# Altium project MarsRover_ScienceTeam.PrjPcb
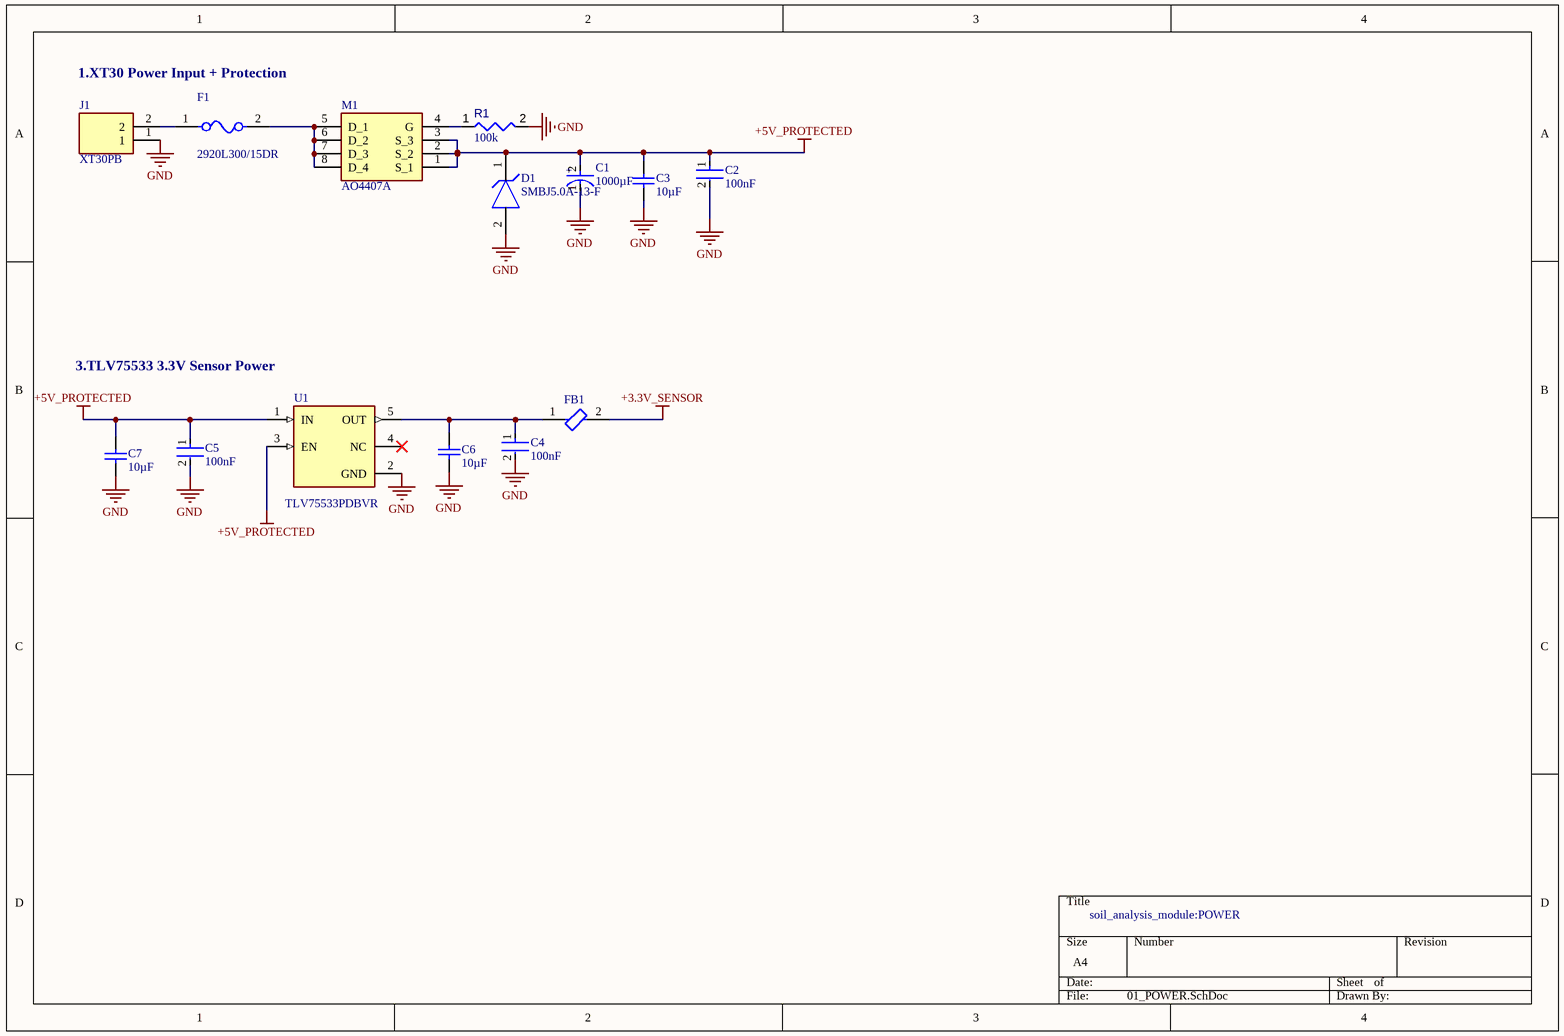
[diagram p0: 01_POWER.SchDoc]
3 sheets, 40 parts. Net scope: global (net labels, ports and power ports of the same name join across sheets).
Board file: PCB1.PcbDoc
Sheets:
  01_POWER.SchDoc
  02_ESP32.SchDoc
  03_CONNECTION.SchDoc

## Sheet 01_POWER.SchDoc
size A4; SheetNumber: 1; SheetTotal: 3

### Parts
C1  value 1000µF  [FP-RAD-TH-D_8_0_5-L_15_1-MFG]  (hidden comment: EEUFR1A102L)
C2  value 100nF  [FP-CC1206-1_25-MFG]  (hidden comment: CC1206KRX7R9BB104)
C3  value 10µF  [CAPC3216X180X55ML20T25]  (hidden comment: GRM31CR71C106KA12L)
C4  value 100nF  [FP-CC1206-1_25-MFG]  (hidden comment: CC1206KRX7R9BB104)
C5  value 100nF  [FP-CC1206-1_25-MFG]  (hidden comment: CC1206KRX7R9BB104)
C6  value 10µF  [CAPC3216X180X55ML20T25]  (hidden comment: GRM31CR71C106KA12L)
C7  value 10µF  [CAPC3216X180X55ML20T25]  (hidden comment: GRM31CR71C106KA12L)
D1  SMBJ5.0A-13-F  [FP-SMB-MFG]
F1  2920L300/15DR  [FP-2920L-MFG]
FB1  BLM31PG121SN1L  [FP-BLM31-0_2-t1_1-MFG]  (value not drawn)
J1  XT30PB  [XT30PB-Footprint-1]
M1  AO4407A  [AO4407A-Footprint-1]
R1  value 100k  [RESC3216X60X45ML15T20]  (hidden comment: Resistor 100k +/-1% 1206 250 mW)
U1  TLV75533PDBVR  [FP-DBV0005A-MFG]

### Nets
+3.3V_SENSOR: FB1.2
+5V_PROTECTED: C1.2(A) C2.1 C3.2 C5.1 C7.2 D1.1(C) M1.1(S_1) M1.2(S_2) M1.3(S_3) U1.1(IN) U1.3(EN)
GND: C1.1(C) C2.2 C3.1 C4.2 C5.2 C6.1 C7.1 D1.2(A) J1.1 R1.2 U1.2(GND)
NetC4_1: C4.1 C6.2 FB1.1 U1.5(OUT)
NetF1_1: F1.1 J1.2
NetF1_2: F1.2 M1.5(D_1) M1.6(D_2) M1.7(D_3) M1.8(D_4)
NetM1_4: M1.4(G) R1.1

Not connected (* = marked no-connect by the designer): U1 4(NC)*

### Notes on the sheet
- 1.XT30 Power Input + Protection
- 3.TLV75533 3.3V Sensor Power
- soil_analysis_module:POWER
- (in symbol CMP-001-00099-1) +

### Library data of the parts
C1 = CMP-001-00099-1: Aluminum Electrolytic Capacitor, 1000 uF, 10 V, ± 20%, 8000 hours @ 105°C, Radial Leaded; Ripple Current (AC): 1.24A; Voltage Rating: 10V; Max Operating Temperature: 105°C; Mounting Technology: PCB, Through Hole; Ripple Current: 1.24A; Case/Package: Radial; Min Operating Temperature: -40°C; Tolerance: 20%; Pins: 2
C2 C4 C5 = CMP-001-00101-1: 50V 100nF X7R ±10% 1206 Multilayer Ceramic Capacitors MLCC - SMD/SMT ROHS; Case/Package: 1206; Tolerance: 10%; Max Operating Temperature: 125°C; Voltage Rating: 50V; Mounting Technology: Surface Mount; Pins: 2; Min Operating Temperature: -55°C
C3 C6 C7 = CMP-001-00100-1: 16V 10uF X7R ±10% 1206 Multilayer Ceramic Capacitors MLCC - SMD/SMT ROHS; Pins: 2; Tolerance: 10%; Voltage Rating: 16V; Mounting Technology: Surface Mount; Max Operating Temperature: 125°C; Min Operating Temperature: -55°C; Case/Package: 1206
D1 = CMP-004-00035-1: SMBJ5.0A Series 600 W 5.0 V Surface Mount Uni-Directional TVS Diode - DO-214AA; Forward Voltage: 5V; Max Surge Current: 65.2A; Pins: 2; Min Operating Temperature: -55°C; Max Operating Temperature: 150°C; Mounting Technology: Surface Mount; Case/Package: SMB
F1 = CMP-005-00015-1: PTC Resettable Fuses; 2920L300/15DR; LITTELFUSE; 5 A; 3 A; 20 s; 2920; Current Rating: 40A; Max Operating Temperature: 85°C; Mounting Technology: Surface Mount; Case/Package: 2920; Min Operating Temperature: -40°C
FB1 = CMP-009-00180-1: Ferrite Beads Multi-Layer 120Ohm 25% 100MHz 3.5A 0.02Ohm DCR 1206 T/R; Case/Package: 1206; Min Operating Temperature: -55°C; Tolerance: 25%; Mounting Technology: Surface Mount; Max Operating Temperature: 125°C
J1 = CMP-002-00071-1: Mini XT60 XT30 Connector for RC Multirotor Racing Drone Quadcopter; Pins: 4
M1 = CMP-013-00036-1: Mosfet P-ch 30V 12A 8SOIC / Trans Mosfet P-ch 30V 12A 8-PIN SOIC; Case/Package: SOIC; Pins: 8; Max Operating Temperature: 150°C; Min Operating Temperature: -55°C; Mounting Technology: Surface Mount
R1 = CMP-009-00025-5: Chip Resistor, 100 KOhm, +/- 1%, 0.25 W, -55 to 155 degC, 1206 (3216 Metric); Voltage Rating: 200V; Power: 250mW; RoHS Compliant: True; Max Operating Temperature: 155°C; Pins: 2; Tolerance: 1%; Mounting Technology: SM; Case/Package: 1206; Min Operating Temperature: -55°C
U1 = CMP-014-00007-1: 500mA high-PSRR low-IQ low-dropout voltage regulator with enable 5-SOT-23 -40 to 125; Max Supply Voltage: 5.5V; Min Supply Voltage: 1.45V; Max Operating Temperature: 125°C; Pins: 5; Case/Package: SOT-23; Min Operating Temperature: -40°C

## Sheet 02_ESP32.SchDoc
size A; SheetNumber: 2; SheetTotal: 3
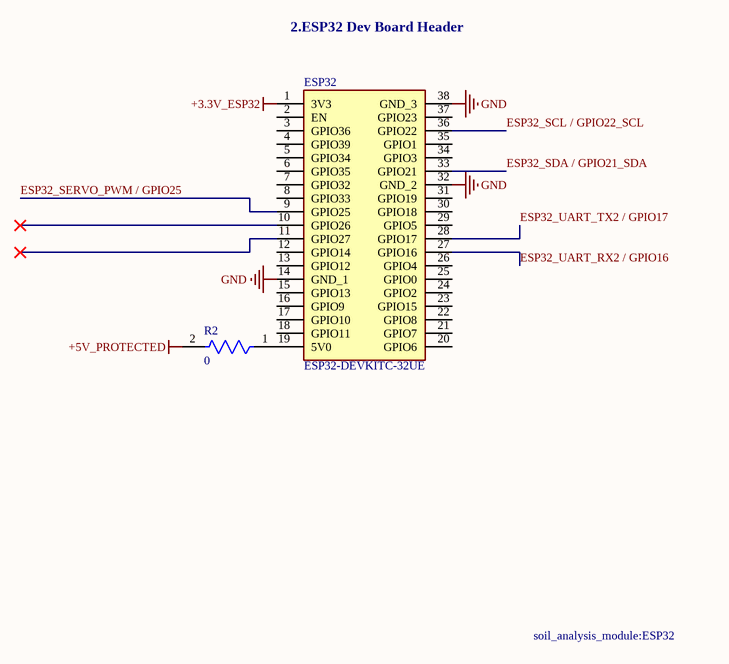
[diagram p1: 02_ESP32.SchDoc]

### Parts
ESP32  ESP32-DEVKITC-32UE  [ESP32-DEVKITC-32UE-Footprint-1]
R2  value 0  [FP-RC1206-MFG]  (hidden comment: RC1206JR-070RL)

### Nets
+3.3V_ESP32: ESP32.1(3V3)
+5V_PROTECTED: R2.2
GND: ESP32.14(GND_1) ESP32.32(GND_2) ESP32.38(GND_3)
ESP32_SCL / GPIO22_SCL: ESP32.36(GPIO22)
ESP32_SDA / GPIO21_SDA: ESP32.33(GPIO21)
ESP32_SERVO_PWM / GPIO25: ESP32.9(GPIO25)
ESP32_UART_RX2 / GPIO16: ESP32.27(GPIO16)
ESP32_UART_TX2 / GPIO17: ESP32.28(GPIO17)
NetESP32_19: ESP32.19(5V0) R2.1

Not connected (* = marked no-connect by the designer): ESP32 2(EN) 3(GPIO36) 4(GPIO39) 5(GPIO34) 6(GPIO35) 7(GPIO32) 8(GPIO33) 10(GPIO26)* 11(GPIO27)* 12(GPIO14) 13(GPIO12) 15(GPIO13) 16(GPIO9) 17(GPIO10) 18(GPIO11) 20(GPIO6) 21(GPIO7) 22(GPIO8) 23(GPIO15) 24(GPIO2) 25(GPIO0) 26(GPIO4) 29(GPIO5) 30(GPIO18) 31(GPIO19) 34(GPIO3) 35(GPIO1) 37(GPIO23)

### Notes on the sheet
- 2.ESP32 Dev Board Header
- soil_analysis_module:ESP32

### Library data of the parts
ESP32 = CMP-020-00024-1: ESP32-WROOM-32UE Series Evaluation Board 802.11 b/g/n (WiFi, WLAN) Bluetooth Smart Ready 4.x Dual Mode
R2 = CMP-009-00183-1: GENERAL PURPOSE CHIP RESISTOR Metal Glaze/thick Film, 0.25W, 0ohm, Surface Mount, 1206; Voltage Rating: 200V; Tolerance: 5%; Max Operating Temperature: 155°C; Pins: 2; Case/Package: 1206; Mounting Technology: Surface Mount; Min Operating Temperature: -55°C

## Sheet 03_CONNECTION.SchDoc
size A; SheetNumber: 3; SheetTotal: 3
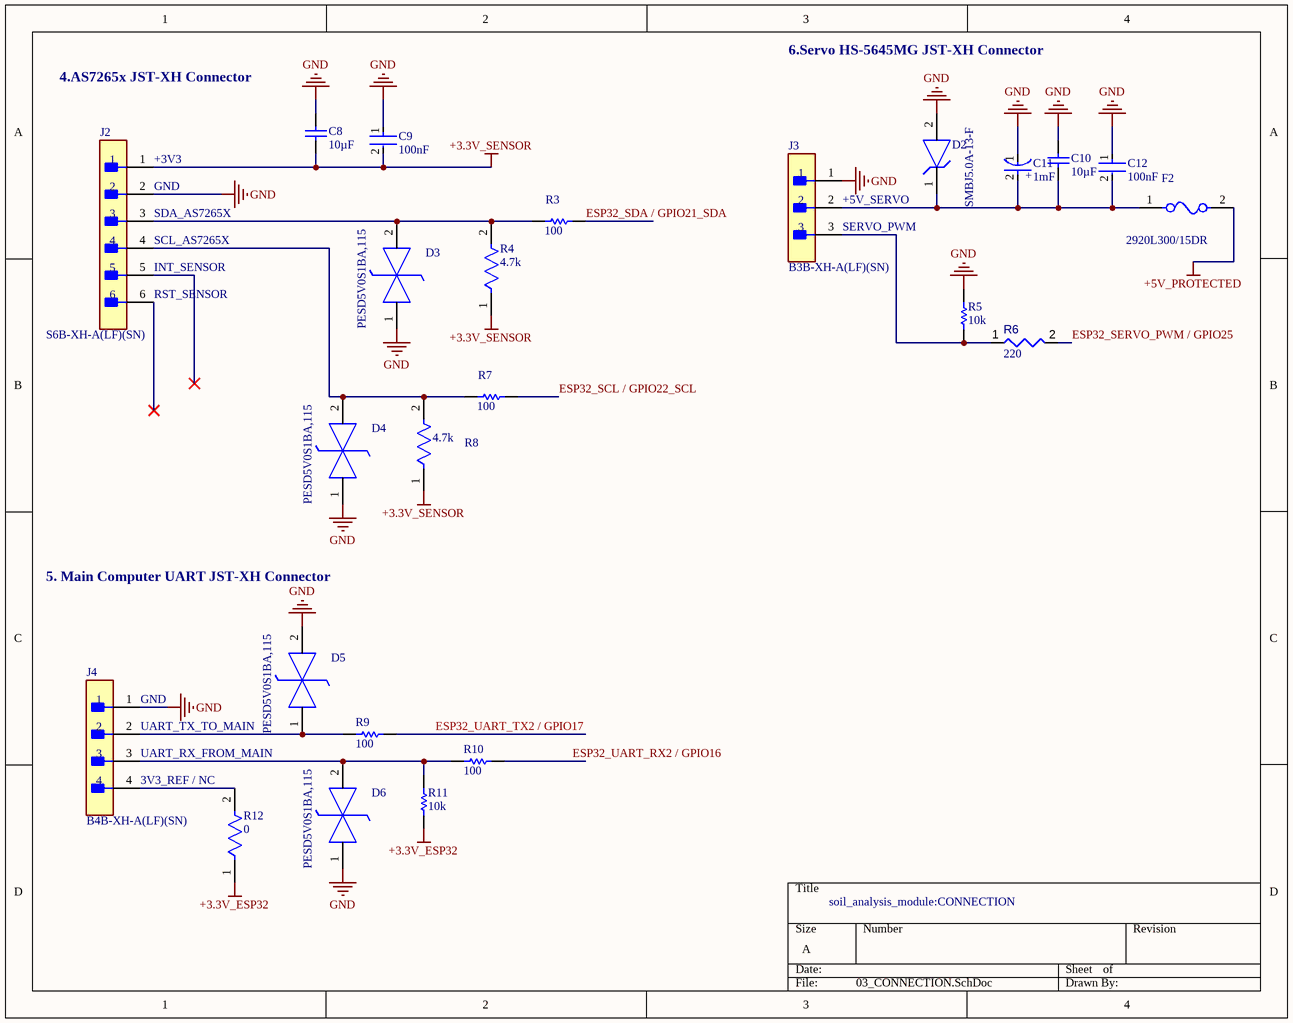
[diagram p2: 03_CONNECTION.SchDoc]

### Parts
C8  value 10µF  [CAPC3216X180X55ML20T25]  (hidden comment: GRM31CR71C106KA12L)
C9  value 100nF  [FP-CC1206-1_25-MFG]  (hidden comment: CC1206KRX7R9BB104)
C10  value 10µF  [CAPC3216X180X55ML20T25]  (hidden comment: GRM31CR71C106KA12L)
C11  value 1mF  [FP-RAD-TH-D_8_0_5-L_15_1-MFG]  (hidden comment: EEUFR1A102L)
C12  value 100nF  [FP-CC1206-1_25-MFG]  (hidden comment: CC1206KRX7R9BB104)
D2  SMBJ5.0A-13-F  [FP-SMB-MFG]
D3  PESD5V0S1BA,115  [PESD5V0S1BA,115-Footprint-1]
D4  PESD5V0S1BA,115  [PESD5V0S1BA,115-Footprint-1]
D5  PESD5V0S1BA,115  [PESD5V0S1BA,115-Footprint-1]
D6  PESD5V0S1BA,115  [PESD5V0S1BA,115-Footprint-1]
F2  2920L300/15DR  [FP-2920L-MFG]
J2  S6B-XH-A(LF)(SN)  [FP-S6B-XH-A_LF_SN-MFG]
J3  B3B-XH-A(LF)(SN)  [FP-B3B-XH-A_LF_SN-MFG]
J4  B4B-XH-A(LF)(SN)  [FP-B4B-XH-A_LF_SN-MFG]
R3  value 100  [RESC3116X65X40LL10T20]  (hidden comment: RC1206FR-07100RL)
R4  value 4.7k  [FP-RC1206-0_65-MFG]  (hidden comment: RC1206FR-074K7L)
R5  value 10k  [RESC3116X65X40ML10T20]  (hidden comment: RC1206FR-0710KL)
R6  value 220  [RC1206FR-07220RL-Footprint-1]  (hidden comment: RC1206FR-07220RL)
R7  value 100  [RESC3116X65X40LL10T20]  (hidden comment: RC1206FR-07100RL)
R8  value 4.7k  [FP-RC1206-0_65-MFG]  (hidden comment: RC1206FR-074K7L)
R9  value 100  [RESC3116X65X40LL10T20]  (hidden comment: RC1206FR-07100RL)
R10  value 100  [RESC3116X65X40LL10T20]  (hidden comment: RC1206FR-07100RL)
R11  value 10k  [RESC3116X65X40ML10T20]  (hidden comment: RC1206FR-0710KL)
R12  value 0  [FP-RC1206-MFG]  (hidden comment: RC1206JR-070RL)

### Nets
+3.3V_ESP32: R11.1 R12.1
+3.3V_SENSOR: C8.1 C9.2 J2.1 R4.1 R8.1
+5V_PROTECTED: F2.2
GND: C8.2 C9.1 C10.2 C11.1(C) C12.1 D2.2(A) D3.1(K1) D4.1(K1) D5.2(K2) D6.1(K1) J2.2 J3.1 J4.1 R5.2
ESP32_SCL / GPIO22_SCL: R7.2
ESP32_SDA / GPIO21_SDA: R3.2
ESP32_SERVO_PWM / GPIO25: R6.2
ESP32_UART_RX2 / GPIO16: R10.2
ESP32_UART_TX2 / GPIO17: R9.2
NetC10_1: C10.1 C11.2(A) C12.2 D2.1(C) F2.1 J3.2
NetD3_2: D3.2(K2) J2.3 R3.1 R4.2
NetD4_2: D4.2(K2) J2.4 R7.1 R8.2
NetD5_1: D5.1(K1) J4.2 R9.1
NetD6_2: D6.2(K2) J4.3 R10.1 R11.2
NetJ3_3: J3.3 R5.1 R6.1
NetJ4_4: J4.4 R12.2

Not connected (* = marked no-connect by the designer): J2 5* 6*

### Notes on the sheet
- 4.AS7265x JST-XH Connector
- 6.Servo HS-5645MG JST-XH Connector
- (near J2) +3V3
- (near J2) GND
- (near J2) SDA_AS7265X
- (near J3) +5V_SERVO
- (near J3) SERVO_PWM
- (near J2) SCL_AS7265X
- (near J2) INT_SENSOR
- (near J2) RST_SENSOR
- 5. Main Computer UART JST-XH Connector
- (near J4) GND
- (near J4) UART_TX_TO_MAIN
- (near J4) UART_RX_FROM_MAIN
- 3V3_REF / NC
- soil_analysis_module:CONNECTION
- (in symbol CMP-001-00099-1) +

### Library data of the parts
C8 C10 = CMP-001-00100-1: as C3 on sheet 01_POWER; Pins: 2; Tolerance: 10%; Voltage Rating: 16V; Mounting Technology: Surface Mount; Max Operating Temperature: 125°C; Min Operating Temperature: -55°C; Case/Package: 1206
C9 C12 = CMP-001-00101-1: as C2 on sheet 01_POWER; Case/Package: 1206; Tolerance: 10%; Max Operating Temperature: 125°C; Voltage Rating: 50V; Mounting Technology: Surface Mount; Pins: 2; Min Operating Temperature: -55°C
C11 = CMP-001-00099-1: as C1 on sheet 01_POWER; Max Operating Temperature: 105°C; Mounting Technology: PCB, Through Hole; Ripple Current: 1.24A; Case/Package: Radial; Min Operating Temperature: -40°C; Tolerance: 20%; Pins: 2
D2 = CMP-004-00035-1: as D1 on sheet 01_POWER; Pins: 2; Min Operating Temperature: -55°C; Max Operating Temperature: 150°C; Mounting Technology: Surface Mount; Case/Package: SMB
D3-D6 = CMP-004-00037-2: Tvs Diodes & Esd Suppressors; PESD5V0S1BA, 115; Nexperia; 5 V; 2; 14 V; 5.5 V; Max Surge Current: 12A; Case/Package: SC; Max Operating Temperature: 150°C; Mounting Technology: Surface Mount; Min Operating Temperature: -65°C; Pins: 2
F2 = CMP-005-00015-1: as F1 on sheet 01_POWER; Max Operating Temperature: 85°C; Mounting Technology: Surface Mount; Case/Package: 2920; Min Operating Temperature: -40°C
J2 = CMP-002-00072-1: Board Connector, 6 Contact(s), 1 Row(s), Male, Right Angle, Solder Terminal, ROHS COMPLIANT; Connector Type: Male Pin; Voltage Rating: 250V; Max Current Rating: 3A; Min Operating Temperature: -25°C; Mounting Technology: Through Hole; Max Operating Temperature: 85°C; Gender: Male; Pins: 6
J3 = CMP-002-00074-1: Connector Header, XH Series, 3 Position, 2.50mm, Through Hole, Press-Fit, Solder, Natural; Voltage Rating: 250V; Gender: Male; Connector Type: Male Pin; Max Current Rating: 3A; Pins: 3; Min Operating Temperature: -25°C; Mounting Technology: Through Hole; Max Operating Temperature: 85°C
J4 = CMP-002-00073-1: Connector Header, 4 Positions, 2.50mm, Solder, Detent Lock, Natural; Connector Type: Male Pin; Max Current Rating: 3A; Voltage Rating: 250V; Gender: Male; Min Operating Temperature: -25°C; Pins: 4; Max Operating Temperature: 85°C; Mounting Technology: Through Hole
R3 R7 R9 R10 = CMP-009-00178-1: Res Thick Film 1206 100 Ohm 1% 0.25W(1/4W) ±100ppm/C Pad SMD T/R; Voltage Rating: 200V; Max Operating Temperature: 155°C; Tolerance: 1%; Min Operating Temperature: -55°C; Case/Package: 1206; Mounting Technology: Surface Mount; Pins: 2
R4 R8 = CMP-009-00181-1: Res Thick Film 1206 4.7K Ohm 1% 0.25W(1/4W) ±100ppm/C Pad SMD T/R; Voltage Rating: 200V; Max Operating Temperature: 155°C; Mounting Technology: Surface Mount; Case/Package: 1206; Min Operating Temperature: -55°C; Tolerance: 1%; Pins: 2
R5 R11 = CMP-009-00182-1: 250Mw Thick Film Resistors 100Ppm/ 1% 10K 1206 Chip Resistor Surface Mount Rohs; Voltage Rating: 200V; Min Operating Temperature: -55°C; Mounting Technology: Surface Mount; Max Operating Temperature: 155°C; Tolerance: 1%; Case/Package: 1206; Pins: 2
R6 = CMP-009-00179-1: 250mW Thick Film Resistors 200V ±100ppm/℃ ±1% 220Ω 1206 Chip Resistor - Surface Mount ROHS; Case/Package: 1206; Tolerance: 1%; Min Operating Temperature: -55°C; Mounting Technology: Surface Mount; Voltage Rating: 200V; Pins: 2; Max Operating Temperature: 155°C
R12 = CMP-009-00183-1: as R2 on sheet 02_ESP32; Max Operating Temperature: 155°C; Pins: 2; Case/Package: 1206; Mounting Technology: Surface Mount; Min Operating Temperature: -55°C

## Nets that join several sheets
+3.3V_ESP32: 02_ESP32 (ESP32.1), 03_CONNECTION (R11.1 R12.1)
+3.3V_SENSOR: 01_POWER (FB1.2), 03_CONNECTION (5 pins)
+5V_PROTECTED: 01_POWER (11 pins), 02_ESP32 (R2.2), 03_CONNECTION (F2.2)
GND: 01_POWER (11 pins), 02_ESP32 (ESP32.14 ESP32.32 ESP32.38), 03_CONNECTION (14 pins)
ESP32_SCL / GPIO22_SCL: 02_ESP32 (ESP32.36), 03_CONNECTION (R7.2)
ESP32_SDA / GPIO21_SDA: 02_ESP32 (ESP32.33), 03_CONNECTION (R3.2)
ESP32_SERVO_PWM / GPIO25: 02_ESP32 (ESP32.9), 03_CONNECTION (R6.2)
ESP32_UART_RX2 / GPIO16: 02_ESP32 (ESP32.27), 03_CONNECTION (R10.2)
ESP32_UART_TX2 / GPIO17: 02_ESP32 (ESP32.28), 03_CONNECTION (R9.2)